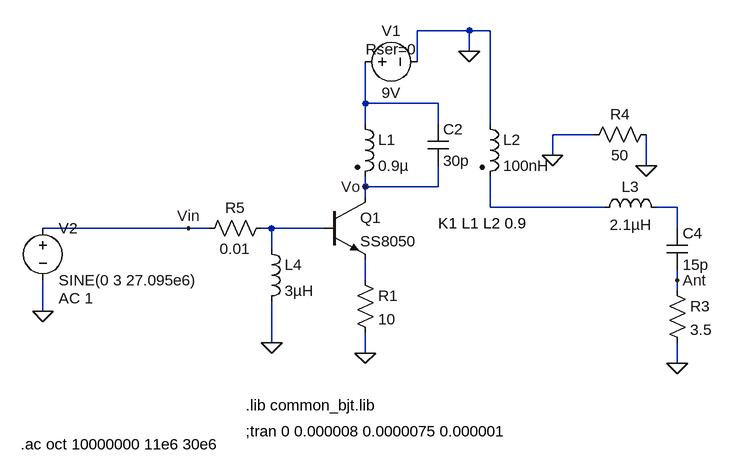
[diagram p0: schematic 27Mhz-PA-tankout.asc]
27Mhz-PA-tankout.asc, the LTspice schematic file:
Version 4
SHEET 1 880 680
WIRE 352 -160 272 -160
WIRE 384 -160 352 -160
WIRE 352 -128 352 -160
WIRE 272 -112 272 -160
WIRE 192 -48 192 -112
WIRE 304 -48 192 -48
WIRE 192 -16 192 -48
WIRE 304 -16 304 -48
WIRE 384 -16 384 -160
WIRE 544 0 480 0
WIRE 480 32 480 0
WIRE 624 48 624 0
WIRE 192 80 192 64
WIRE 304 80 304 48
WIRE 304 80 192 80
WIRE 192 96 192 80
WIRE 384 112 384 64
WIRE 560 112 384 112
WIRE 672 112 640 112
WIRE -80 144 -304 144
WIRE -48 144 -80 144
WIRE 48 144 32 144
WIRE 128 144 48 144
WIRE 672 144 672 112
WIRE 48 176 48 144
WIRE 192 224 192 192
WIRE 672 224 672 208
WIRE 672 240 672 224
WIRE -304 272 -304 224
WIRE 48 320 48 256
WIRE 192 336 192 304
WIRE 672 352 672 320
FLAG 192 336 0
FLAG 48 320 0
FLAG 352 -128 0
FLAG 672 352 0
FLAG -304 272 0
FLAG 672 224 Ant
FLAG 624 48 0
FLAG -80 144 Vin
FLAG 192 80 Vo
FLAG 480 32 0
SYMBOL res 176 208 R0
SYMATTR InstName R1
SYMATTR Value 10
SYMATTR SpiceLine tol=1% pwr=1
SYMBOL ind2 176 -32 R0
SYMATTR InstName L1
SYMATTR Value 0.9µ
SYMATTR SpiceLine Ipk=1 Rser=0.0478 Rpar=1e4 Cpar=0
SYMATTR Type ind
SYMBOL cap 288 -16 R0
SYMATTR InstName C2
SYMATTR Value 30p
SYMATTR SpiceLine V=100 Irms=1 Rser=0.01 Lser=0 Rpar=1e5 Cpar=0
SYMBOL npn 128 96 R0
SYMATTR InstName Q1
SYMATTR Value SS8050
SYMBOL ind 544 128 R270
WINDOW 0 32 56 VTop 2
WINDOW 3 5 56 VBottom 2
SYMATTR InstName L3
SYMATTR Value 2.1µH
SYMATTR SpiceLine Ipk=1 Rser=0.03 Rpar=1e4 Cpar=0.3p
SYMBOL cap 656 144 R0
SYMATTR InstName C4
SYMATTR Value 15p
SYMATTR SpiceLine V=100 Irms=0.7 Rser=0.03 Lser=10nH Rpar=1e5 Cpar=0
SYMBOL res 656 224 R0
SYMATTR InstName R3
SYMATTR Value 3.5
SYMATTR SpiceLine tol=1% pwr=1
SYMBOL voltage 176 -112 R270
WINDOW 0 32 56 VTop 2
WINDOW 3 -32 56 VBottom 2
WINDOW 123 0 0 Left 2
WINDOW 39 4 56 VTop 2
SYMATTR InstName V1
SYMATTR Value 9V
SYMATTR SpiceLine Rser=0
SYMBOL voltage -304 128 R0
WINDOW 123 24 124 Left 2
WINDOW 39 0 0 Left 2
SYMATTR Value2 AC 1
SYMATTR InstName V2
SYMATTR Value SINE(0 3 27.095e6)
SYMBOL res 528 16 R270
WINDOW 0 32 56 VTop 2
WINDOW 3 0 56 VBottom 2
SYMATTR InstName R4
SYMATTR Value 50
SYMATTR SpiceLine tol=1% pwr=1
SYMBOL res -64 160 R270
WINDOW 0 32 56 VTop 2
WINDOW 3 0 56 VBottom 2
SYMATTR InstName R5
SYMATTR Value 0.01
SYMATTR SpiceLine tol=1% pwr=1
SYMBOL ind 32 160 R0
SYMATTR InstName L4
SYMATTR Value 3µH
SYMATTR SpiceLine Ipk=1 Rser=0.0478 Rpar=1e4 Cpar=0
SYMBOL ind2 368 -32 R0
SYMATTR InstName L2
SYMATTR Value 100nH
SYMATTR SpiceLine Ipk=1 Rser=0.0478 Rpar=1e4 Cpar=0
SYMATTR Type ind
TEXT 8 416 Left 2 !.lib common_bjt.lib
TEXT 8 456 Left 2 !;tran 0 0.000008 0.0000075 0.000001
TEXT 304 136 Left 2 !K1 L1 L2 0.9
TEXT -338 476 Left 2 !.ac oct 10000000 11e6 30e6

The netlist it stands for:
* 27Mhz-PA-tankout.asc
R1 N005 0 10 tol=1% pwr=1
L1 N001 Vo 0.9µ Ipk=1 Rser=0.0478 Rpar=1e4 Cpar=0
C2 N001 Vo 30p V=100 Irms=1 Rser=0.01 Lser=0 Rpar=1e5 Cpar=0
Q1 Vo N004 N005 0 SS8050
L3 N002 N003 2.1µH Ipk=1 Rser=0.03 Rpar=1e4 Cpar=0.3p
C4 N003 Ant 15p V=100 Irms=0.7 Rser=0.03 Lser=10nH Rpar=1e5 Cpar=0
R3 Ant 0 3.5 tol=1% pwr=1
V1 N001 0 9V Rser=0
V2 Vin 0 SINE(0 3 27.095e6) AC 1
R4 0 0 50 tol=1% pwr=1
R5 Vin N004 0.01 tol=1% pwr=1
L4 N004 0 3µH Ipk=1 Rser=0.0478 Rpar=1e4 Cpar=0
L2 0 N002 100nH Ipk=1 Rser=0.0478 Rpar=1e4 Cpar=0
.model NPN NPN
.model PNP PNP
.lib standard.bjt
.lib common_bjt.lib
;tran 0 0.000008 0.0000075 0.000001
K1 L1 L2 0.9
.ac oct 10000000 11e6 30e6
.backanno
.end